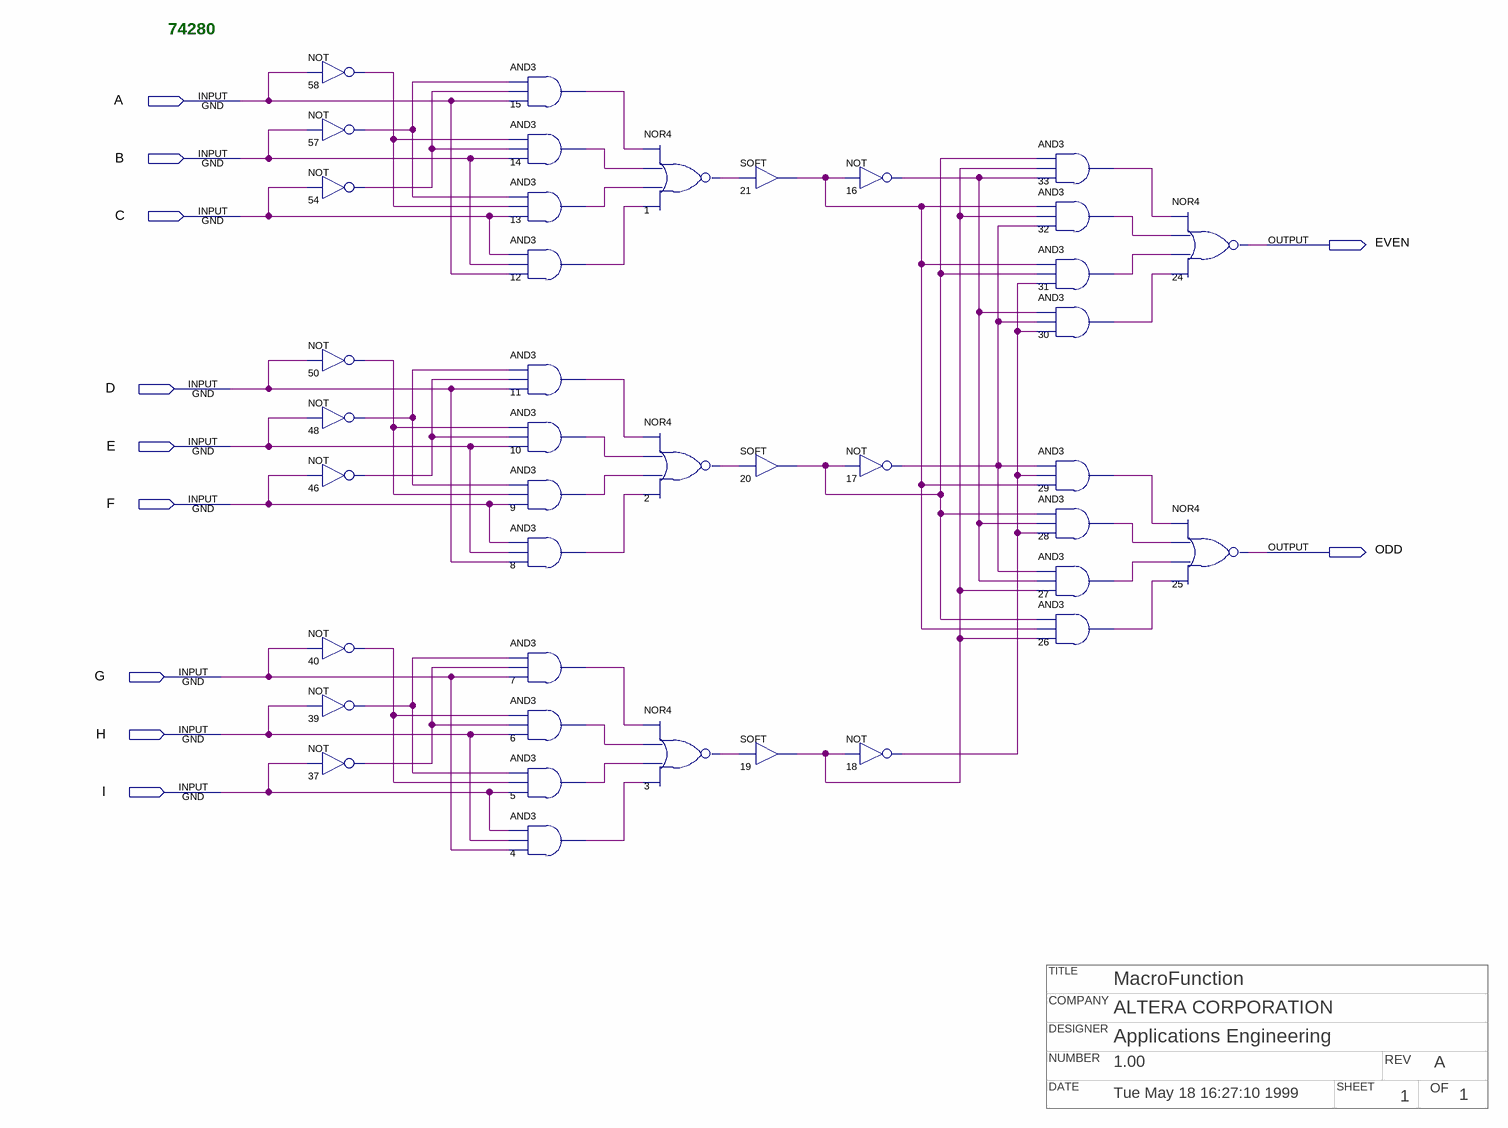
[diagram p0: schematic sheet]
// Quartus schematic 74280.bdf as structural Verilog: 40 symbols, 11 pins
// Title block: TITLE: MacroFunction; COMPANY: ALTERA CORPORATION; DESIGNER: Applications Engineering; NUMBER: 1.00; REV: A; DATE: Tue May 18 16:27:10 1999; SHEET: 1; OF: 1
module \74280  (
  input  A,
  input  B,
  input  C,
  input  D,
  input  E,
  input  F,
  input  G,
  input  H,
  input  I,
  output EVEN,
  output ODD
);

  wire n1_out, n2_out, n3_out, n4_out, n5_out, n6_out, n7_out, n8_out, n9_out, n10_out, n11_out, n12_out,
       n13_out, n14_out, n15_out, n16_out, n17_out, n18_out, n19_out, n20_out, n21_out, n26_out, n27_out,
       n28_out, n29_out, n30_out, n31_out, n32_out, n33_out, n37_out, n39_out, n40_out, n46_out, n48_out,
       n50_out, n54_out, n57_out, n58_out;

  not u_58 (n58_out, A);
  not u_57 (n57_out, B);
  not u_54 (n54_out, C);
  not u_50 (n50_out, D);
  not u_48 (n48_out, E);
  not u_46 (n46_out, F);
  not u_40 (n40_out, G);
  not u_39 (n39_out, H);
  not u_37 (n37_out, I);
  and u_15 (n15_out, n57_out, n54_out, A);
  and u_14 (n14_out, n58_out, n54_out, B);
  and u_13 (n13_out, n57_out, n58_out, C);
  and u_12 (n12_out, C, B, A);
  and u_11 (n11_out, n48_out, n46_out, D);
  and u_10 (n10_out, n50_out, n46_out, E);
  and u_9 (n9_out, n48_out, n50_out, F);
  and u_8 (n8_out, F, E, D);
  and u_7 (n7_out, n39_out, n37_out, G);
  and u_6 (n6_out, n40_out, n37_out, H);
  and u_5 (n5_out, n39_out, n40_out, I);
  and u_4 (n4_out, I, H, G);
  nor u_1 (n1_out, n15_out, n14_out, n13_out, n12_out);
  nor u_2 (n2_out, n11_out, n10_out, n9_out, n8_out);
  nor u_3 (n3_out, n7_out, n6_out, n5_out, n4_out);
  SOFT u_21 (.IN(n1_out), .OUT(n21_out));
  SOFT u_20 (.IN(n2_out), .OUT(n20_out));
  SOFT u_19 (.IN(n3_out), .OUT(n19_out));
  not u_16 (n16_out, n21_out);
  not u_17 (n17_out, n20_out);
  not u_18 (n18_out, n19_out);
  and u_33 (n33_out, n20_out, n19_out, n16_out);
  and u_32 (n32_out, n21_out, n19_out, n17_out);
  and u_31 (n31_out, n21_out, n20_out, n18_out);
  and u_30 (n30_out, n16_out, n17_out, n18_out);
  and u_29 (n29_out, n17_out, n18_out, n21_out);
  and u_28 (n28_out, n20_out, n16_out, n18_out);
  and u_27 (n27_out, n17_out, n16_out, n19_out);
  and u_26 (n26_out, n20_out, n21_out, n19_out);
  nor u_24 (EVEN, n33_out, n32_out, n31_out, n30_out);
  nor u_25 (ODD, n29_out, n28_out, n27_out, n26_out);

  // Notes on the sheet:
  //   74280
endmodule
